# EAGLE design 1P3W_v1p1 (EAGLE 9.6.2)
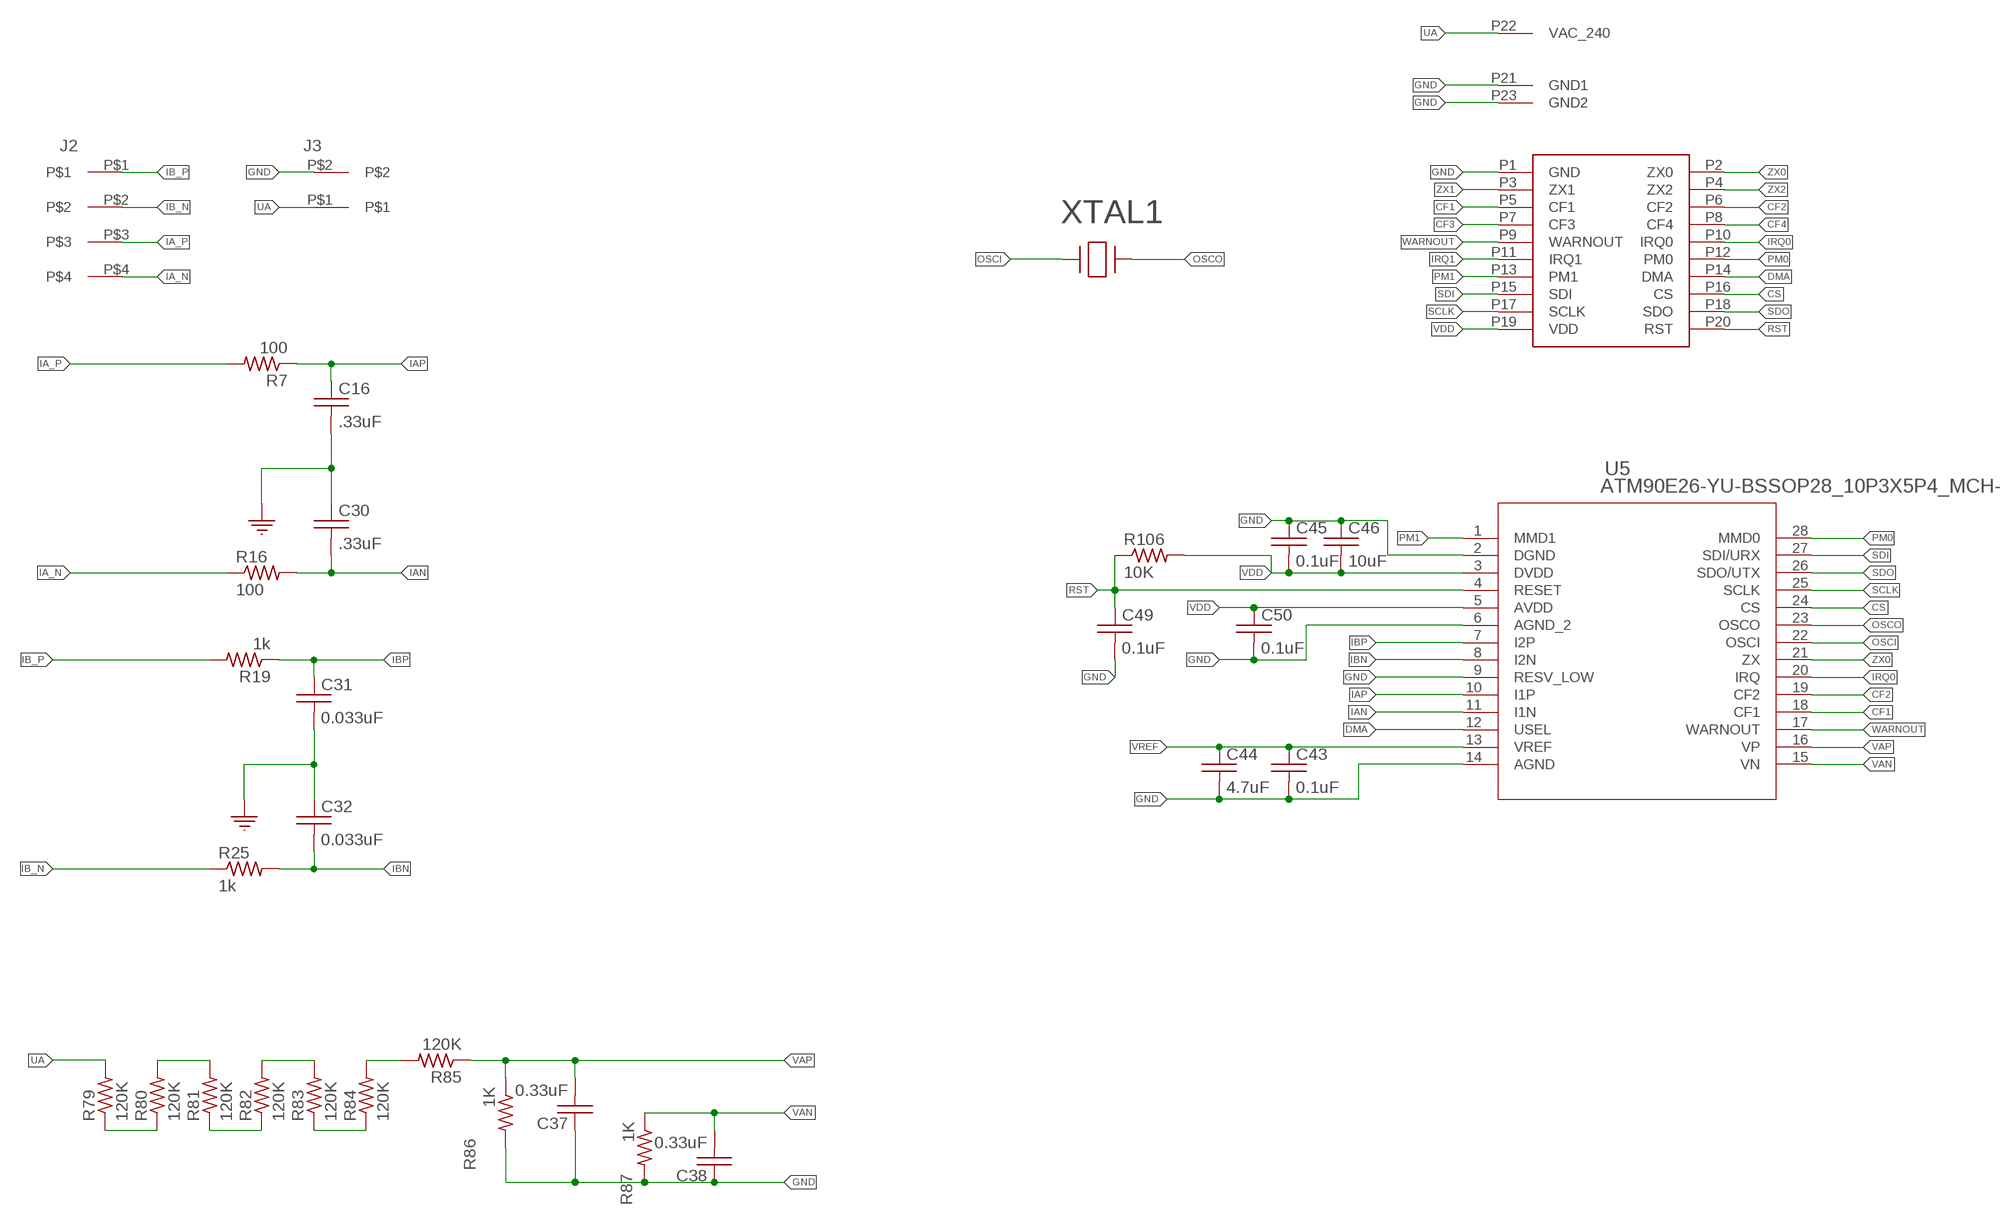
[diagram p0: schematic, sheet 1]

## Parts
C16  .33uF  C_0402  [0402]
C30  .33uF  C_0402  [0402]
C31  0.033uF  C_0402  [0402]
C32  0.033uF  C_0402  [0402]
C37  0.33uF  C_0402  [0402]
C38  0.33uF  C_0402  [0402]
C43  0.1uF  C_0402  [0402]
C44  4.7uF  C_0402  [0402]
C45  0.1uF  C_0402  [0402]
C46  10uF  C_0402  [0402]
C49  0.1uF  C_0402  [0402]
C50  0.1uF  C_0402  [0402]
J2  3.81MM_1_X_4_RT_ANGLE_PLUG_HEADER  [1X4_3.81MM_PITCH]
J3  3.81MM_1_X_2_RT_ANGLE_PLUG_HEADER  [2_3.81MM_PITCH]
R7  100  R_0402  [0402]
R16  100  R_0402  [0402]
R19  1k  R_0402  [0402]
R25  1k  R_0402  [0402]
R79  120K  R_0402  [0402]
R80  120K  R_0402  [0402]
R81  120K  R_0402  [0402]
R82  120K  R_0402  [0402]
R83  120K  R_0402  [0402]
R84  120K  R_0402  [0402]
R85  120K  R_0402  [0402]
R86  1K  R_0402  [0402]
R87  1K  R_0402  [0402]
R106  10K  R_0402  [0402]
U5  ATM90E26-YU-BSSOP28_10P3X5P4_MCH-M  [SSOP28_10P3X5P4_MCH-M]
U$1  METER_BASE  [METER_BASE]
XTAL1  ABLS-8.192MHZ-B2-TXTAL_HC/49US_ABLS_ABR-M  [XTAL_HC/49US_ABLS_ABR-M]

## Nets
CF1: U5.18(CF1) U$1.P5(CF1)
CF2: U5.19(CF2) U$1.P6(CF2)
CF3: U$1.P7(CF3)
CF4: U$1.P8(CF4)
CS: U5.24(CS) U$1.P16(CS)
DMA: U5.12(USEL) U$1.P14(DMA)
GND: C16.P$2 C30.P$1 C31.P$2 C32.P$1 C37.P$1 C38.P$1 C43.P$2 C44.P$2 C45.P$1 C46.P$1 C49.P$2 C50.P$2 J3.P$2 R86.P$2 R87.P$2 U5.2(DGND) U5.6(AGND_2) U5.9(RESV_LOW) U5.14(AGND) U$1.P1(GND) U$1.P21(GND1) U$1.P23(GND2)
IA_N: J2.P$4 R16.P$1
IA_P: J2.P$3 R7.P$2
IAN: C30.P$2 R16.P$2 U5.11(I1N)
IAP: C16.P$1 R7.P$1 U5.10(I1P)
IB_N: J2.P$2 R25.P$1
IB_P: J2.P$1 R19.P$2
IBN: C32.P$2 R25.P$2 U5.8(I2N)
IBP: C31.P$1 R19.P$1 U5.7(I2P)
IRQ0: U5.20(IRQ) U$1.P10(IRQ0)
IRQ1: U$1.P11(IRQ1)
N$37: R79.P$1 R80.P$1
N$38: R80.P$2 R81.P$2
N$39: R81.P$1 R82.P$1
N$40: R82.P$2 R83.P$2
N$41: R83.P$1 R84.P$1
N$42: R84.P$2 R85.P$2
OSCI: U5.22(OSCI) XTAL1.1
OSCO: U5.23(OSCO) XTAL1.2
PM0: U5.28(MMD0) U$1.P12(PM0)
PM1: U5.1(MMD1) U$1.P13(PM1)
RST: C49.P$1 R106.P$1 U5.4(RESET) U$1.P20(RST)
SCLK: U5.25(SCLK) U$1.P17(SCLK)
SDI: U5.27(SDI/URX) U$1.P15(SDI)
SDO: U5.26(SDO/UTX) U$1.P18(SDO)
UA: J3.P$1 R79.P$2 U$1.P22(VAC_240)
VAN: C38.P$2 R87.P$1 U5.15(VN)
VAP: C37.P$2 R85.P$1 R86.P$1 U5.16(VP)
VDD: C45.P$2 C46.P$2 C50.P$1 R106.P$2 U5.3(DVDD) U5.5(AVDD) U$1.P19(VDD)
VREF: C43.P$1 C44.P$1 U5.13(VREF)
WARNOUT: U5.17(WARNOUT) U$1.P9(WARNOUT)
ZX0: U5.21(ZX) U$1.P2(ZX0)
ZX1: U$1.P3(ZX1)
ZX2: U$1.P4(ZX2)

## Library data of the parts
C16 C30-C32 C37 C38 C43-C46 C49 C50 = 3D_MIG_Controller:C_0402
J2 = 3D_MIG_Controller:3.81MM_1_X_4_RT_ANGLE_PLUG_HEADER
J3 = 3D_MIG_Controller:3.81MM_1_X_2_RT_ANGLE_PLUG_HEADER
R7 R16 R19 R25 R79-R87 R106 = 3D_MIG_Controller:R_0402
U5 = 3D_MIG_Controller:ATM90E26-YU-B; BUILT_BY: EMA_Molly; COPYRIGHT: Copyright (C) 2018 Accelerated Designs. All rights reserved; MANUFACTURER_PART_NUMBER: ATM90E26-YU-B; SOURCELIBRARY: Microchip_2019-08-23_24; VENDOR: Microchip
U$1 = 3D_MIG_Controller:METER_BASE
XTAL1 = 3D_MIG_Controller:ABLS-8.192MHZ-B2-T; BUILT_BY: EMA_Cory; COPYRIGHT: Copyright (C) 2018 Accelerated Designs. All rights reserved; DATASHEET: https://abracon.com/Resonators/abls.pdf; MANUFACTURER_PART_NUMBER: ABLS-8.192MHZ-B2-T; SOURCELIBRARY: Abracon_2020-04-08; VENDOR: Abracon

## Board
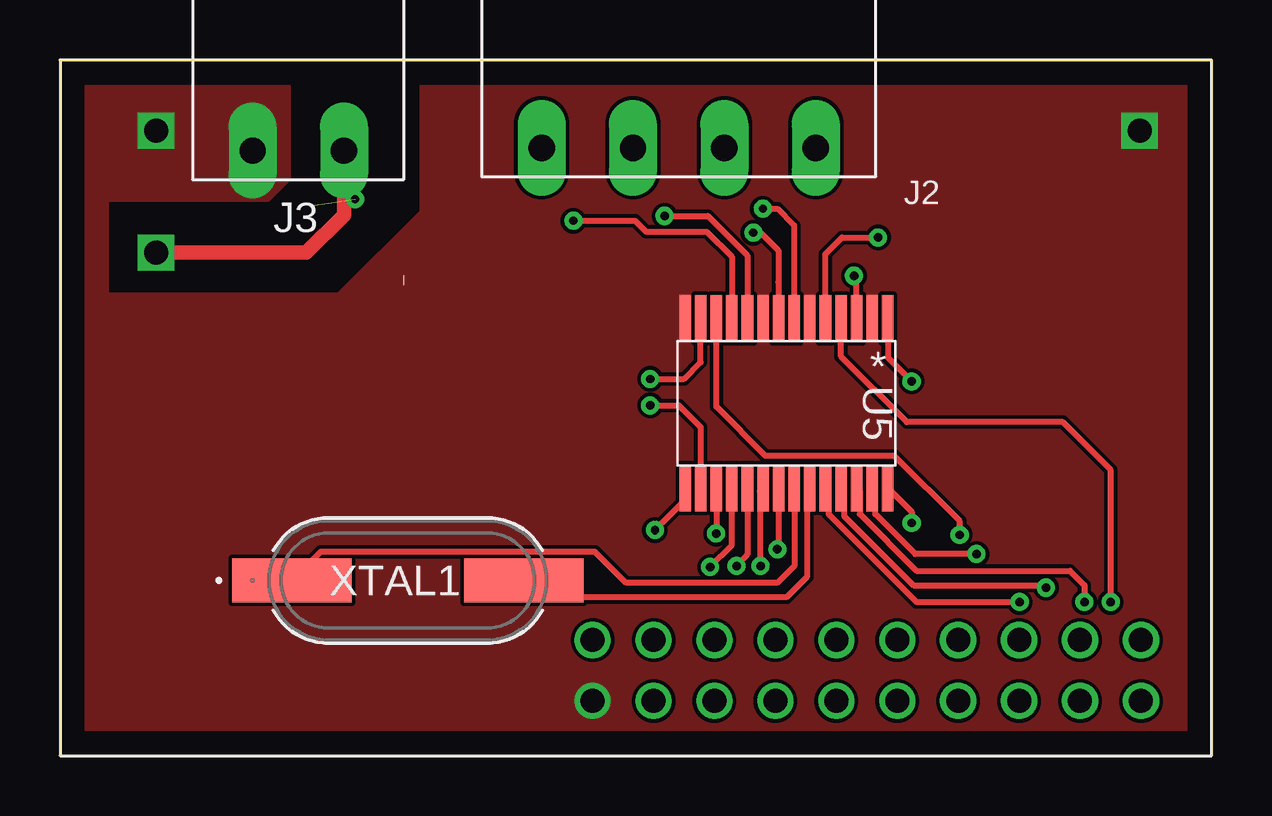
[diagram p1: board, top side]
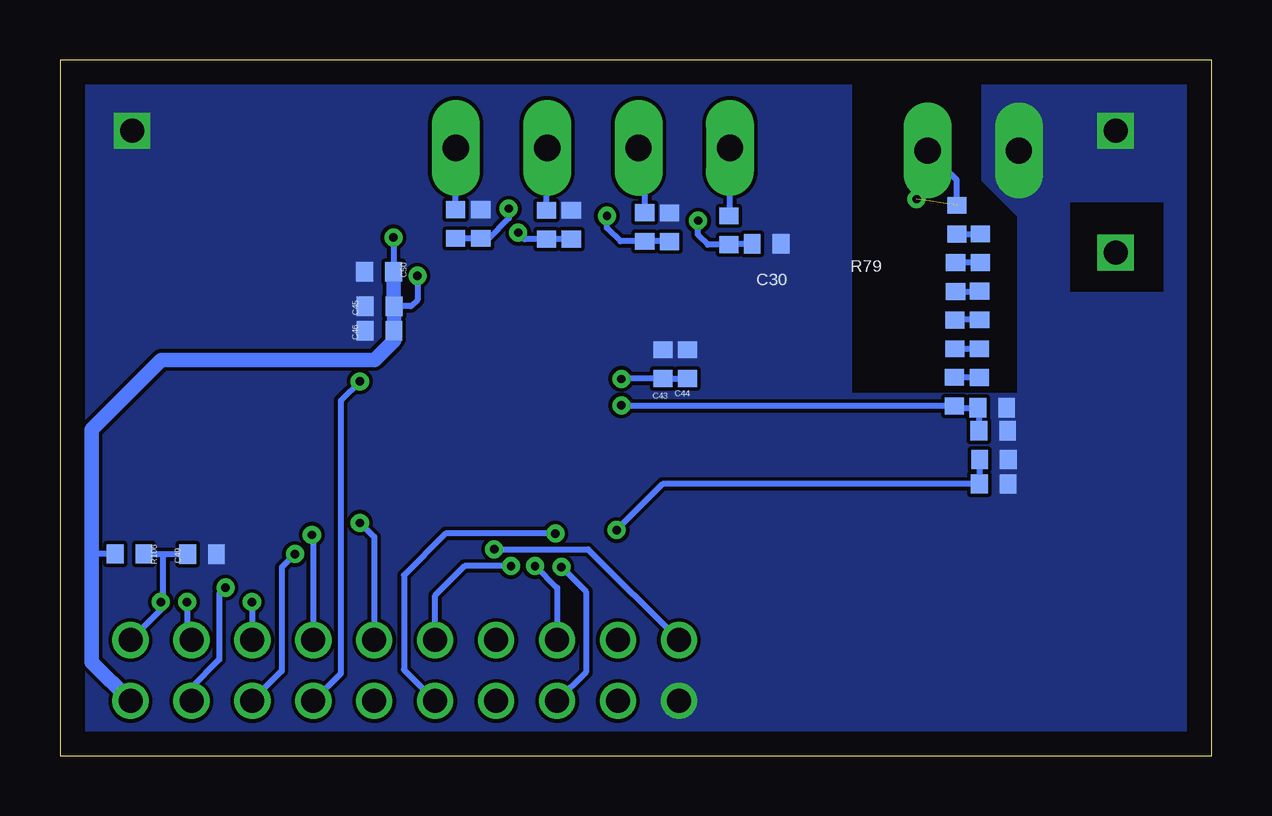
[diagram p2: board, bottom side, seen from below]

Size 48 x 29 mm. Coordinates in mm from the lower left corner, seen from the top.
Outline: 0,0 0,29 48,29 48,0 0,0
Copper layers (1*16): Top 0.035mm / dielectric 1.5mm / Bottom 0.035mm
Design rules "default": minimum track width 6mil, minimum drill 0.35mm, track to track 6mil, track to pad 6mil, pad to pad 6mil, via to via 6mil, smd to smd 6mil, copper to edge 40mil, drill to drill 6mil, minimum pad ring 10mil, minimum via ring 8mil, stop-mask expansion 4mil, vias tented up to drill 0mil, thermal gap 10mil

### Footprints (pad centres in the part's own frame; a part is rotated, then mirrored left to right if it is on the bottom)
0402 = smd 0.8 x 0.7: P$1 0,0.6; P$2 0,-0.6
1X4_3.81MM_PITCH = drill 1.1 pad 2 long: P$1 0,0; P$2 3.81,0; P$3 7.62,0; P$4 11.43,0
2_3.81MM_PITCH = drill 1.1 pad 2 long: P$1 0,0; P$2 3.81,0
SSOP28_10P3X5P4_MCH-M = smd 1.956 x 0.483: 1 -3.531,4.225; 2 -3.531,3.575; 3 -3.531,2.925; 4 -3.531,2.275; 5 -3.531,1.625; 6 -3.531,0.975; 7 -3.531,0.325; 8 -3.531,-0.325; 9 -3.531,-0.975; 10 -3.531,-1.625; 11 -3.531,-2.275; 12 -3.531,-2.925; 13 -3.531,-3.575; 14 -3.531,-4.225; 15 3.531,-4.225; 16 3.531,-3.575; 17 3.531,-2.925; 18 3.531,-2.275; 19 3.531,-1.625; 20 3.531,-0.975; 21 3.531,-0.325; 22 3.531,0.325; 23 3.531,0.975; 24 3.531,1.625; 25 3.531,2.275; 26 3.531,2.925; 27 3.531,3.575; 28 3.531,4.225
METER_BASE = drill 1: P1 22.2,2.276; P2 22.2,4.816; P3 24.74,2.276; P4 24.74,4.816; P5 27.28,2.276; P6 27.28,4.816; P7 29.82,2.276; P8 29.82,4.816; P9 32.36,2.276; P10 32.36,4.816; P11 34.9,2.276; P12 34.9,4.816; P13 37.44,2.276; P14 37.44,4.816; P15 39.98,2.276; P16 39.98,4.816; P17 42.52,2.276; P18 42.52,4.816; P19 45.06,2.276; P20 45.06,4.816 | drill 1 square: P21 4,26.046; P22 4,20.966; P23 45,26.046
XTAL_HC/49US_ABLS_ABR-M = smd 4.978 x 1.829: 1 -4.826,0; 2 4.826,0

### Placement (x,y rotation side)
C16  22.59,22.03 180 bottom
C30  18.55,21.33 270 bottom
C31  30.46,22.16 180 bottom
C32  26.69,22.13 0 bottom
C37  9.1,13.54 270 bottom
C38  9.08,11.32 270 bottom
C43  22.86,16.32 180 bottom
C44  21.84,16.32 180 bottom
C45  34.68,18.73 90 bottom
C46  34.68,17.71 90 bottom
C49  42.08,8.39 90 bottom
C50  34.7,20.17 270 bottom
J2  31.5,25.34 180 top
J3  11.84,25.22 180 top
R7  23.62,22.04 180 bottom
R16  20.11,21.9 0 bottom
R19  31.51,22.16 180 bottom
R25  27.72,22.13 0 bottom
R79  10.62,22.34 180 bottom
R80  9.64,21.15 0 bottom
R81  10.67,19.95 180 bottom
R82  9.67,18.77 0 bottom
R83  10.7,17.56 180 bottom
R84  9.68,16.36 0 bottom
R85  10.72,15.17 180 bottom
R86  9.14,14.5 90 bottom
R87  9.07,12.35 90 bottom
R106  45.1,8.41 270 bottom
U5  30.28,14.69 270 top
U$1  0,0 0 top
XTAL1  14.5,7.3 0 top

### Tracks (layer width: path | path; a pad name or v marks a point on that pad's centre or on a via)
CF1  (via drill 0.35)
  Top 0.254: v27.1,7.86 28,8.76 U5.18
  Bottom 0.254: U$1.P5 26.08,3.48 26.08,6.84 v27.1,7.86
CF2  (via drill 0.35)
  Top 0.254: v28.2,7.9 28.2,7.94 28.66,8.39 U5.19
  Bottom 0.254: U$1.P6 27.28,7 28.18,7.9 v28.2,7.9
CS  (via drill 0.35)
  Top 0.254: U5.24 32.03,11.03 32.03,10.07 35.7,6.4 v40,6.4
  Bottom 0.254: v40,6.4 40,4.79 39.87,4.92 U$1.P16
DMA  (via drill 0.35)
  Top 0.254: v37.5,9.2 37.5,9.78 34.78,12.5 29.4,12.5 27.36,14.54 U5.12
  Bottom 0.254: v37.5,9.2 37.44,9.26 U$1.P14
GND
  Top 0.254: 8.24,23.4 8.03,23.61
  pour Bottom (no thermals): 0,29 9.6,29 9.6,25.9 9.6,24 8.7,23.1 8.1,22.5 8.1,20.6 8.1,14.6 5.9,14.6 5.9,23.1 0,23.1
  pour Bottom (no thermals): 0,24 2,24 2,19.3 8.1,19.3 8.1,15.1 15,15.1 15,29 48,29 48,0 0,0
  pour Top (no thermals): 0,29 9.6,29 9.6,24 8.7,23.1 2,23.1 2,19.3 11.6,19.3 15,22.7 15,29 48,29 48,0 0,0
IA_N
  Bottom 0.254: R16.P$1 20.07,22.54 J2.P$4
IA_P
  Bottom 0.254: R7.P$2 23.62,25.07 J2.P$3
IAN  (via drill 0.35)
  Top 0.254: v21.4,22.3 23.97,22.3 24.43,21.84 26.96,21.84 28,20.8 U5.11
  Bottom 0.254: C30.P$2 20.09,21.33 R16.P$2 21,21.3 21.4,21.7 v21.4,22.3
IAP  (via drill 0.35)
  Top 0.254: v25.2,22.5 27,22.5 28.66,20.84 U5.10
  Bottom 0.254: C16.P$1 22.6,21.44 R7.P$1 24.64,21.44 25.2,22 v25.2,22.5
IB_N
  Bottom 0.254: R25.P$1 27.72,25.31 J2.P$2
IB_P
  Bottom 0.254: R19.P$2 31.51,25.33 J2.P$1
IBN  (via drill 0.35)
  Top 0.254: U5.8 29.95,19.71 29.94,19.73 29.94,21.06 29.2,21.8 v28.9,21.8
  Bottom 0.254: C32.P$2 R25.P$2 28.63,21.53 v28.9,21.8
IBP  (via drill 0.35)
  Top 0.254: v29.3,22.8 29.9,22.8 30.6,22.1 U5.7
  Bottom 0.254: R19.P$1 C31.P$1 30.14,21.56 29.3,22.4 v29.3,22.8
IRQ0  (via drill 0.35)
  Top 0.254: U5.20 29.18,11.03 29.18,7.92 v29.2,7.9
  Bottom 0.254: U$1.P10 32.36,6.67 31.13,7.9 v29.2,7.9
N$37
  Bottom 0.254: R79.P$1 R80.P$1
N$38
  Bottom 0.254: R80.P$2 R81.P$2
N$39
  Bottom 0.254: R81.P$1 9.69,19.35 R82.P$1
N$40
  Bottom 0.254: R82.P$2 R83.P$2
N$41
  Bottom 0.254: R83.P$1 R84.P$1
N$42
  Bottom 0.254: R84.P$2 R85.P$2
OSCI
  Top 0.254: XTAL1.1 10.87,8.5 22.3,8.5 23.6,7.2 29.9,7.2 30.61,7.91 U5.22
OSCO
  Top 0.254: U5.23 31.13,11.03 31.13,7.45 30.27,6.6 20.03,6.6 XTAL1.2
PM0  (via drill 0.35)
  Top 0.254: U5.28 35.5,10.16 v35.5,9.7
  Bottom 0.254: v35.5,9.7 35.48,9.7 34.9,9.12 U$1.P12
PM1  (via drill 0.35)
  Top 0.254: v35.5,15.6 34.51,16.59 U5.1
  Bottom 0.254: U$1.P13 36.3,3.42 36.3,14.8 v35.5,15.6
RST  (via drill 0.35)
  Top 0.254: U5.4 32.55,16.64 35.3,13.9 41.8,13.9 43.8,11.9 v43.8,6.4
  Bottom 0.254: U$1.P20 43.8,6.08 v43.8,6.4 43.7,6.5 43.7,8.39 | C49.P$1 43.7,8.39 | 43.7,8.39 44.49,8.39 R106.P$1
SCLK  (via drill 0.35)
  Top 0.254: U5.25 32.68,11.03 32.68,9.99 35.58,7.1 41,7.1 v41.1,7
  Bottom 0.254: v41.1,7 41.36,6.74 41.36,4 42.52,2.84 U$1.P17
SDI  (via drill 0.35)
  Top 0.254: U5.27 33.98,11.03 33.98,10.07 35.65,8.4 v38.2,8.4
  Bottom 0.254: U$1.P15 39.98,2.31 38.76,3.53 38.76,7.84 v38.2,8.4
SDO  (via drill 0.35)
  Top 0.254: U5.26 33.33,11.03 33.33,10.07 35.7,7.7 42.1,7.7 42.7,7.1 v42.7,6.4
  Bottom 0.254: v42.7,6.4 42.7,4.95 42.66,4.91 U$1.P18
UA  (via drill 0.35)  (1 unrouted)
  Top 0.61: U$1.P22 10.27,20.97 11.84,22.54 J3.P$1
  Bottom 0.254: R79.P$2 10.62,24 J3.P$1
  other vias: 12.3,23.2
VAN  (via drill 0.35)
  Top 0.254: v24.8,9.4 26.05,10.65 U5.15
  Bottom 0.254: R87.P$1 C38.P$2 22.88,11.32 v24.8,9.4
VAP  (via drill 0.35)
  Top 0.254: v24.6,14.6 25.8,14.6 26.7,13.7 U5.16
  Bottom 0.254: C37.P$2 9.7,14.46 R86.P$1 10.65,14.5 R85.P$1 24.57,14.57 v24.6,14.6
VDD  (via drill 0.35)
  Top 0.254: U5.5 31.91,20.91 32.6,21.6 v34.1,21.6 | U5.3 33.2,19.89 v33.1,20
  Bottom 0.254: R106.P$2 46.57,8.41 46.67,8.3 | v34.1,21.6 C50.P$1 | v33.1,20 33.1,19 33.37,18.73 C45.P$2
  Bottom 0.61: U$1.P19 46.67,3.89 46.67,8.3 46.67,13.6 43.77,16.5 34.89,16.5 34.08,17.31 C46.P$2 C45.P$2 34.1,18.75 C50.P$1
VREF  (via drill 0.35)
  Top 0.254: v24.6,15.7 26,15.7 26.7,16.41 U5.13
  Bottom 0.254: C44.P$1 C43.P$1 24.58,15.72 v24.6,15.7
WARNOUT  (via drill 0.35)
  Top 0.254: U5.17 v27.36,9.27 v27.35,9.26
  Bottom 0.254: v27.35,9.26 31.92,9.26 33.66,7.52 33.66,3.58 U$1.P9
ZX0  (via drill 0.35)
  Top 0.254: U5.21 29.95,8.65 v29.9,8.6
  Bottom 0.254: U$1.P2 25.98,8.6 v29.9,8.6